# EAGLE schematic Buck_Converter_schm (EAGLE 9.6.2)
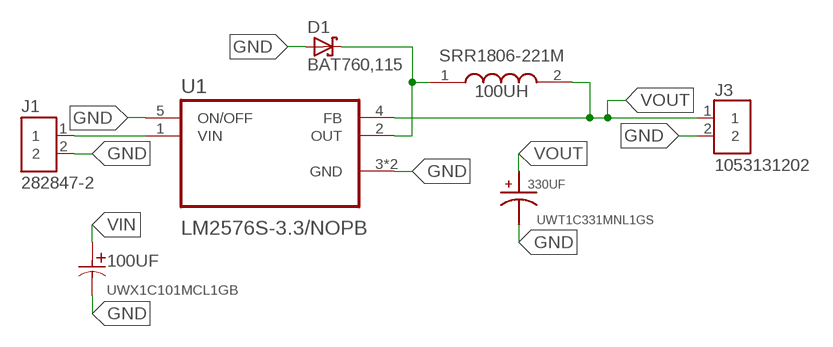
[diagram p0: schematic, sheet 1]

## Parts
100UF  UWX1C101MCL1GB  [PCAP_6.3X5.4-ELECT_NCA]
100UH  SRR1806-221M  [SRR1806221M]
330UF  UWT1C331MNL1GS  [CAPAE830X1080N]
D1  BAT760,115  [SOD323(F)]
J1  282847-2  [TE_282847-2]
J3  1053131202  [MOLEX_1053131202]
U1  LM2576S-3.3/NOPB  [VREG_TPS79625KTTR]

## Nets
GND: 100UF.2 330UF.2 D1.2(A) J1.2 J3.2 U1.3(GND) U1.5(ON/OFF) U1.6(GND)
N$4: 100UH.1 D1.1(K) U1.2(OUT)
VIN: 100UF.1 J1.1 U1.1(VIN)
VOUT: 100UH.2 330UF.1 J3.1 U1.4(FB)

## Library data of the parts
100UF = UWX1C101MCL1GB:UWX1C101MCL1GB; BUILT_BY: EMA_UL_Team; MANUFACTURER_PART_NUMBER: UWX1C101MCL1GB; SOURCELIBRARY: Nichicon_2011-10-21; VENDOR: Nichicon
100UH = SamacSys_Parts:SRR1806-221M: Fixed Inductors 220uH 20% SMD 1806 Source: Datasheet <https://www.bourns.com/docs/Product-Datasheets/SRR1806.pdf>; DESCRIPTION: Fixed Inductors 220uH 20% SMD 1806; HEIGHT: 6.8mm; MANUFACTURER_NAME: Bourns; MANUFACTURER_PART_NUMBER: SRR1806-221M; MOUSER_PART_NUMBER: 652-SRR1806-221M; MOUSER_PRICE-STOCK: https://www.mouser.co.uk/ProductDetail/Bourns/SRR1806-221M?qs=y9m3SKnhpLNwsaEdB1HCDQ%3D%3D
330UF = UWT1C331MNL1GS:UWT1C331MNL1GS: 8mm x 10mm 105deg Rohs=Yes 330uf 16-Volt Surface Mtg/Pkg Aluminum Electrolytic Cap; DESCRIPTION: 330µF 16V Aluminum Electrolytic Capacitors Radial, Can - SMD 1000 Hrs @ 105°C; DIGI-KEY_PART_NUMBER: 493-2180-1-ND; MF: Nichicon; MP: UWT1C331MNL1GS; PACKAGE: Radial Nichicon; PURCHASE-URL: https://pricing.snapeda.com/search/part/UWT1C331MNL1GS/?ref=eda
D1 = BAT760_115:BAT760,115: Medium power Schottky barrier single diode Planar medium power Schottky barrier single diode with an integrated guard ring for stress protection, encapsulated in a SOD323 (SC-76) very small Surface-Mounted Device SMD plastic package. AAL Eindhoven MK Check prices <https://pricing.snapeda.com/parts/BAT760%2C115/Nexperia%20USA/view-part?ref=eda>; AVAILABILITY: Good; DESCRIPTION: Diode Schottky 20V 1A (DC) Surface Mount SOD-323; MF: Nexperia USA; MP: BAT760,115; PACKAGE: SOD323-2 Nexperia USA Inc.; PRICE: None; PURCHASE-URL: https://pricing.snapeda.com/search/part/BAT760,115/?ref=eda
J1 = 282847-2:282847-2: Wire to Board 2 Position 5.08 mm Pitch 30-12 AWG Euro Style Terminal Block Check prices <https://pricing.snapeda.com/parts/282847-2/TE%20Connectivity/view-part?ref=eda>; AVAILABILITY: Good; CENTERLINE_PITCH: 5.08 mm[.2 in]; COMMENT: 282847-2; DESCRIPTION: Conn Terminal Block 2 POS 5.08mm Solder ST Thru-Hole 17.5A/Contact; EU_ROHS_COMPLIANCE: Compliant with Exemptions; MF: TE Connectivity; MP: 282847-2; NUMBER_OF_POSITIONS: 2; PACKAGE: None; PRICE: None; PURCHASE-URL: https://pricing.snapeda.com/search/part/282847-2/?ref=eda
J3 = 1053131202:1053131202: Nano-Fit Right Angle Header; Through Hole; 2.50mm; Single Row; 2 Circuit; Gold Plated Check prices <https://pricing.snapeda.com/parts/1053131202/Molex/view-part?ref=eda>; AVAILABILITY: Warning; DESCRIPTION: Connector Header Through Hole, Right Angle 2 position 0.098 (2.50mm); MF: Molex; MP: 1053131202; PACKAGE: None; PRICE: None; PURCHASE-URL: https://pricing.snapeda.com/search/part/1053131202/?ref=eda
U1 = LM2576S-3.3_NOPB:LM2576S-3.3/NOPB: Check prices <https://pricing.snapeda.com/parts/LM2576S-3.3/NOPB/Texas%20Instruments/view-part?ref=eda>; AVAILABILITY: Warning; DESCRIPTION: SIMPLE SWITCHER&reg; 40V, 3A Low Component Count Step-Down Regulator 5-DDPAK/TO-263 -40 to 125; MF: Texas Instruments; MP: LM2576S-3.3/NOPB; PACKAGE: TO-263-5 Texas Instruments; PRICE: None; PURCHASE-URL: https://pricing.snapeda.com/search/part/LM2576S-3.3/NOPB/?ref=eda